# Altium schematic sheet [03] BLE_KEY_LED.SchDoc: BLE module, LEDs, keypad, buzzer
size A3; Engineer: M. Folejewski; DocumentNumber: 3; SheetNumber: 3; SheetTotal: 4; PageSize: A3; Designators: 1-99
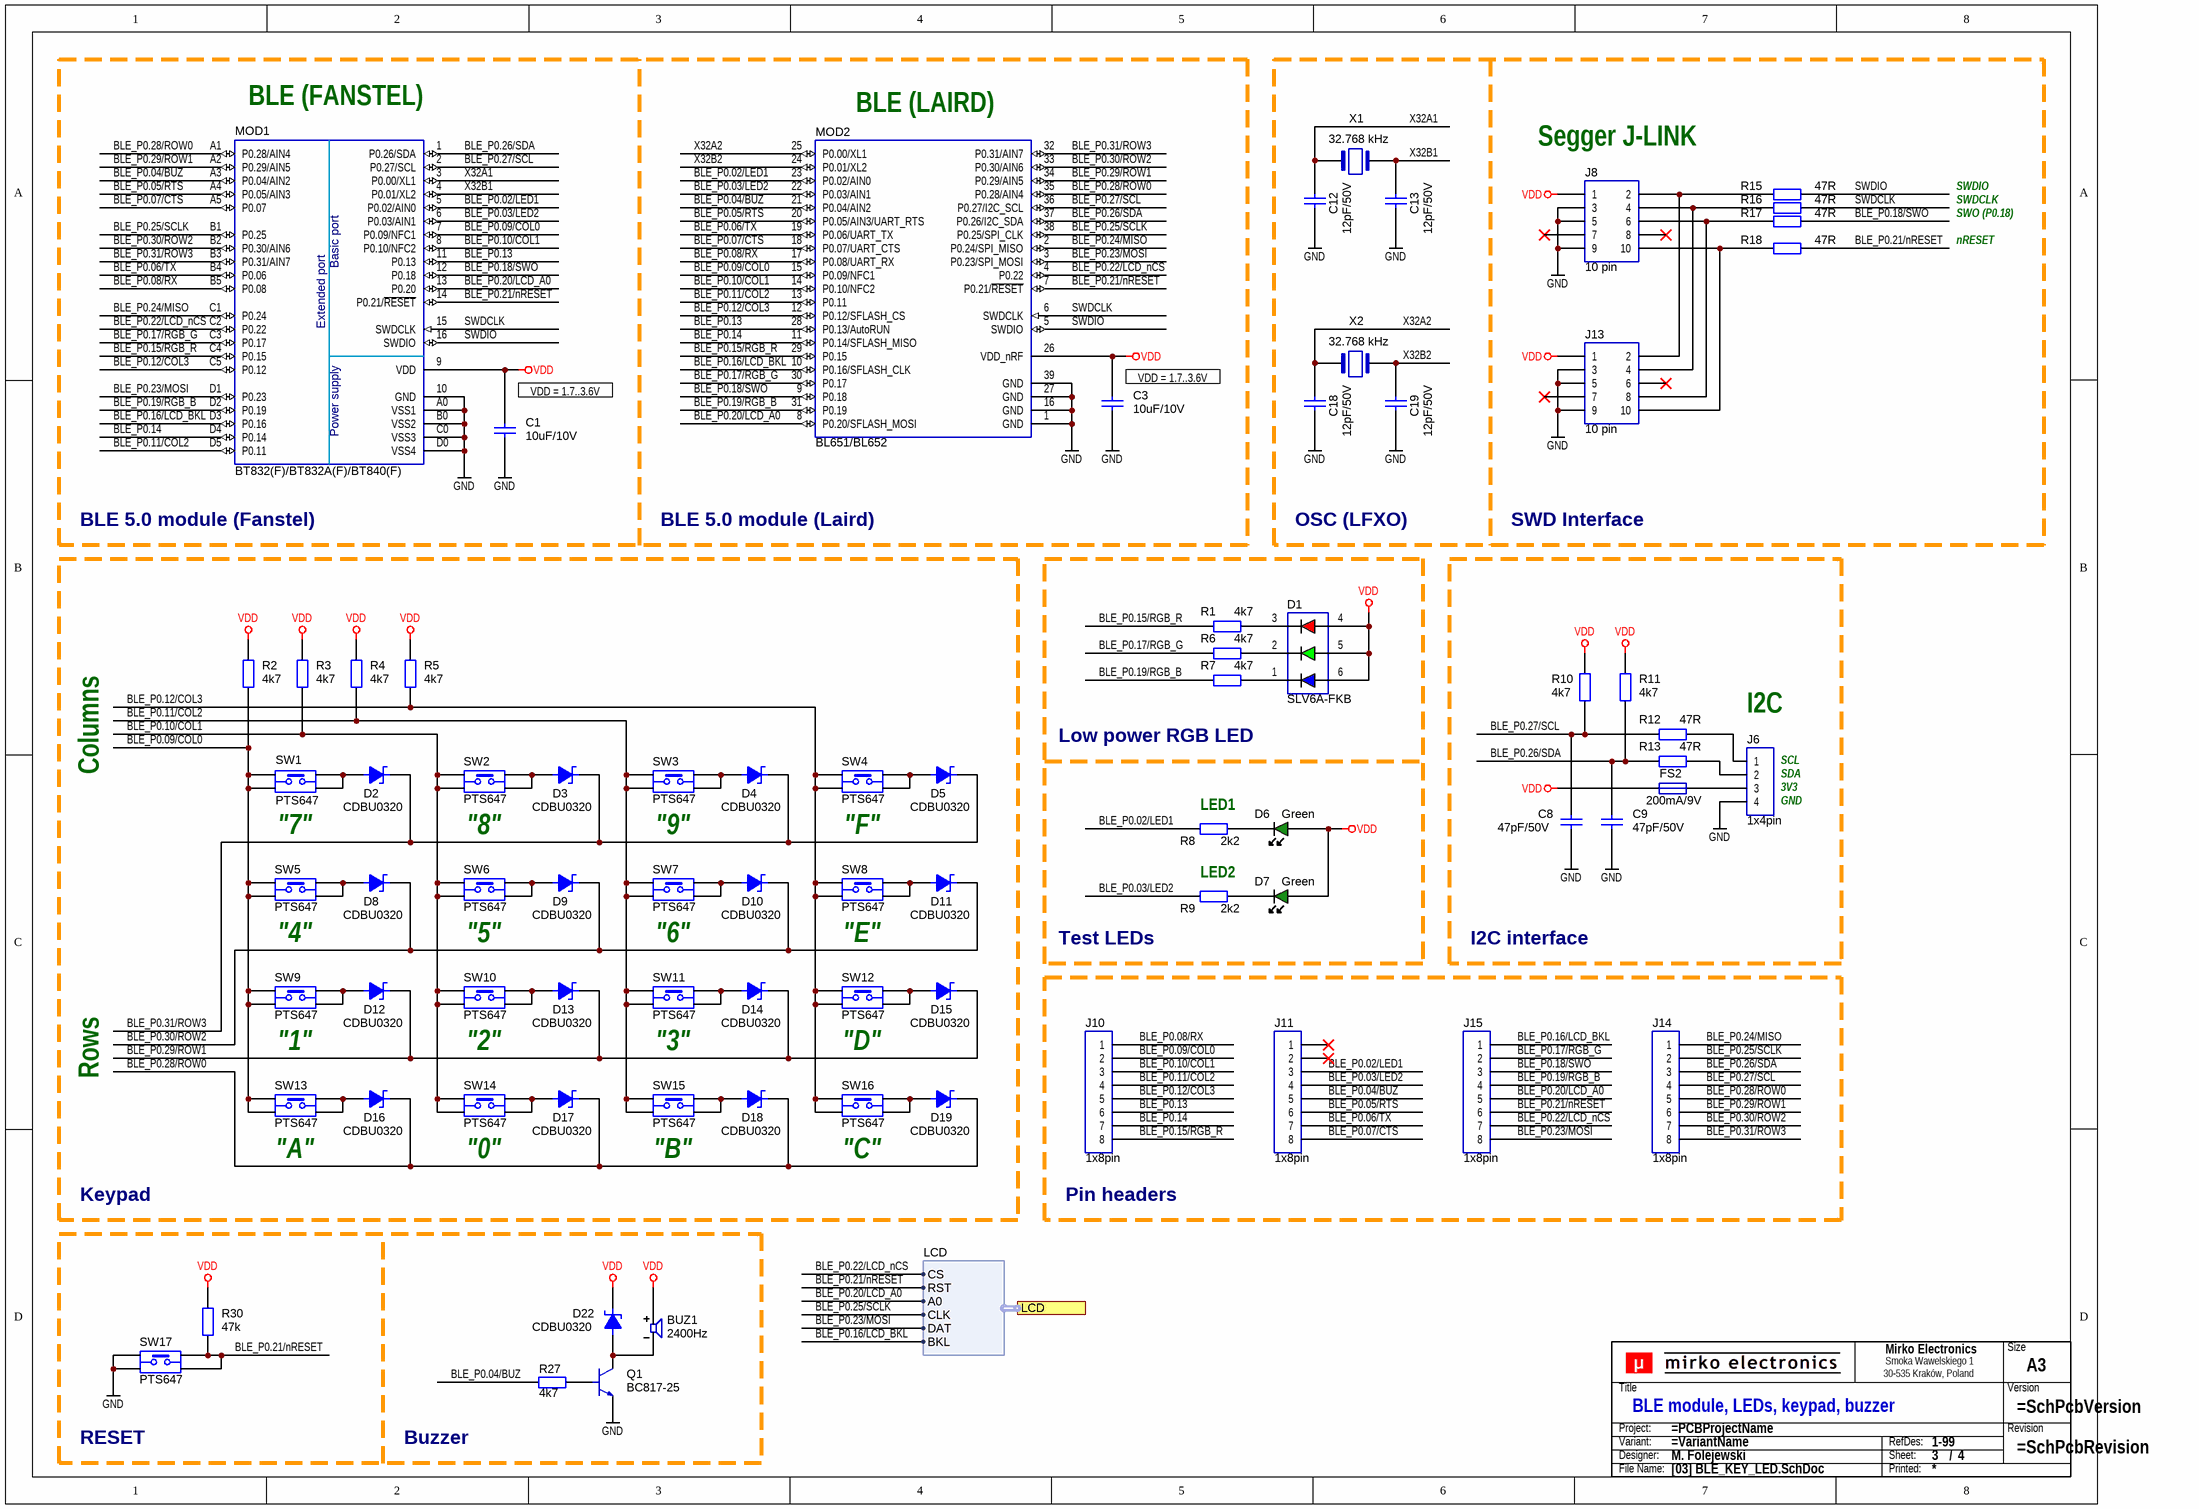
[diagram p0: [03] BLE_KEY_LED.SchDoc]

## Parts
BUZ1  2400Hz  [BUZ_LDT_SMB07]
C1  10uF/10V  [CAP_0805R]
C3  10uF/10V  [CAP_0805R]
C8  47pF/50V  [CAP_0603R]
C9  47pF/50V  [CAP_0603R]
C12  12pF/50V  [CAP_0603R]
C13  12pF/50V  [CAP_0603R]
C18  12pF/50V  [CAP_0603R]
C19  12pF/50V  [CAP_0603R]
D1  SLV6A-FKB  [LED_CRE_PLCC6_550_550]
D2  CDBU0320  [DIO_0603R]
D3  CDBU0320  [DIO_0603R]
D4  CDBU0320  [DIO_0603R]
D5  CDBU0320  [DIO_0603R]
D6  Green  [LED_0603R]
D7  Green  [LED_0603R]
D8  CDBU0320  [DIO_0603R]
D9  CDBU0320  [DIO_0603R]
D10  CDBU0320  [DIO_0603R]
D11  CDBU0320  [DIO_0603R]
D12  CDBU0320  [DIO_0603R]
D13  CDBU0320  [DIO_0603R]
D14  CDBU0320  [DIO_0603R]
D15  CDBU0320  [DIO_0603R]
D16  CDBU0320  [DIO_0603R]
D17  CDBU0320  [DIO_0603R]
D18  CDBU0320  [DIO_0603R]
D19  CDBU0320  [DIO_0603R]
D22  CDBU0320  [DIO_0603R]
FS2  200mA/9V  [FUS_ECE_SR0XX]
J6  1x4pin  [CON_WRT_691321100004]
J8  10 pin  [CON_SMT_FTSH-105-01-L-DV-K]
J10  1x8pin  [CON_HDR_P254_1X08]
J11  1x8pin  [CON_HDR_P254_1X08]
J13  10 pin  [CON_WRT_61201021621]
J14  1x8pin  [CON_HDR_P254_1X08]
J15  1x8pin  [CON_HDR_P254_1X08]
MOD1  BT832(F)/BT832A(F)/BT840(F)  [MOD_FNS_BT832_BT840_A/AF]
MOD2  BL651/BL652  [MOD_LRD_BL651_BL652]
Q1  BC817-25  [PKG_SOT23-3_TO236]
R1  4k7  [RES_0603R]
R2  4k7  [RES_0603R]
R3  4k7  [RES_0603R]
R4  4k7  [RES_0603R]
R5  4k7  [RES_0603R]
R6  4k7  [RES_0603R]
R7  4k7  [RES_0603R]
R8  2k2  [RES_0603R]
R9  2k2  [RES_0603R]
R10  4k7  [RES_0603R]
R11  4k7  [RES_0603R]
R12  47R  [RES_0603R]
R13  47R  [RES_0603R]
R15  47R  [RES_0603R]
R16  47R  [RES_0603R]
R17  47R  [RES_0603R]
R18  47R  [RES_0603R]
R27  4k7  [RES_0603R]
R30  47k  [RES_0603R]
SW1  PTS647  [SWI_CKS_PTS647Sx38]
SW2  PTS647  [SWI_CKS_PTS647Sx38]
SW3  PTS647  [SWI_CKS_PTS647Sx38]
SW4  PTS647  [SWI_CKS_PTS647Sx38]
SW5  PTS647  [SWI_CKS_PTS647Sx38]
SW6  PTS647  [SWI_CKS_PTS647Sx38]
SW7  PTS647  [SWI_CKS_PTS647Sx38]
SW8  PTS647  [SWI_CKS_PTS647Sx38]
SW9  PTS647  [SWI_CKS_PTS647Sx38]
SW10  PTS647  [SWI_CKS_PTS647Sx38]
SW11  PTS647  [SWI_CKS_PTS647Sx38]
SW12  PTS647  [SWI_CKS_PTS647Sx38]
SW13  PTS647  [SWI_CKS_PTS647Sx38]
SW14  PTS647  [SWI_CKS_PTS647Sx38]
SW15  PTS647  [SWI_CKS_PTS647Sx38]
SW16  PTS647  [SWI_CKS_PTS647Sx38]
SW17  PTS647  [SWI_CKS_PTS647Sx38]
TB?  Title block  (value not drawn)  (graphical)
X1  32.768 kHz  [OSC_EPS_FC-135]
X2  32.768 kHz  [OSC_EPS_FC-135]

## Ports
LCD (harness LCD)

## Harnesses
LCD: CS, RST, A0, CLK, DAT, BKL

## Nets
GND: C1.1 C3.1 C8.1 C9.1 C12.1 C13.1 C18.1 C19.1 J6.4 J8.3 J8.5 J8.9 J13.3 J13.5 J13.9 MOD1.10(GND) MOD1.A0(VSS1) MOD1.B0(VSS2) MOD1.C0(VSS3) MOD1.D0(VSS4) MOD2.1(GND) MOD2.16(GND) MOD2.27(GND) MOD2.39(GND) Q1.2(E) SW17.1 SW17.2
VDD: BUZ1.2 C1.2 C3.2 D1.4(AR) D1.5(AG) D1.6(AB) D6.2(A) D7.2(A) D22.1 FS2.1 J8.1 J13.1 MOD1.9(VDD) MOD2.26(VDD_nRF) R2.2 R3.2 R4.2 R5.2 R10.2 R11.2 R30.2
BLE_P0.02/LED1: J11.3 MOD1.5(P0.02/AIN0) MOD2.23(P0.02/AIN0) R8.2
BLE_P0.03/LED2: J11.4 MOD1.6(P0.03/AIN1) MOD2.22(P0.03/AIN1) R9.2
BLE_P0.04/BUZ: J11.5 MOD1.A3(P0.04/AIN2) MOD2.21(P0.04/AIN2) R27.2
BLE_P0.05/RTS: J11.6 MOD1.A4(P0.05/AIN3) MOD2.20(P0.05/AIN3/UART_RTS)
BLE_P0.06/TX: J11.7 MOD1.B4(P0.06) MOD2.19(P0.06/UART_TX)
BLE_P0.07/CTS: J11.8 MOD1.A5(P0.07) MOD2.18(P0.07/UART_CTS)
BLE_P0.08/RX: J10.1 MOD1.B5(P0.08) MOD2.17(P0.08/UART_RX)
BLE_P0.09/COL0: J10.2 MOD1.7(P0.09/NFC1) MOD2.15(P0.09/NFC1) R2.1 SW1.1 SW1.2 SW5.1 SW5.2 SW9.1 SW9.2 SW13.1 SW13.2
BLE_P0.10/COL1: J10.3 MOD1.8(P0.10/NFC2) MOD2.14(P0.10/NFC2) R3.1 SW2.1 SW2.2 SW6.1 SW6.2 SW10.1 SW10.2 SW14.1 SW14.2
BLE_P0.11/COL2: J10.4 MOD1.D5(P0.11) MOD2.13(P0.11) R4.1 SW3.1 SW3.2 SW7.1 SW7.2 SW11.1 SW11.2 SW15.1 SW15.2
BLE_P0.12/COL3: J10.5 MOD1.C5(P0.12) MOD2.12(P0.12/SFLASH_CS) R5.1 SW4.1 SW4.2 SW8.1 SW8.2 SW12.1 SW12.2 SW16.1 SW16.2
BLE_P0.13: J10.6 MOD1.11(P0.13) MOD2.28(P0.13/AutoRUN)
BLE_P0.14: J10.7 MOD1.D4(P0.14) MOD2.11(P0.14/SFLASH_MISO)
BLE_P0.15/RGB_R: J10.8 MOD1.C4(P0.15) MOD2.29(P0.15) R1.1
BLE_P0.16/LCD_BKL: J15.1 MOD1.D3(P0.16) MOD2.10(P0.16/SFLASH_CLK) ; port LCD.BKL
BLE_P0.17/RGB_G: J15.2 MOD1.C3(P0.17) MOD2.30(P0.17) R6.1
BLE_P0.18/SWO: J15.3 MOD1.12(P0.18) MOD2.9(P0.18) R17.1
BLE_P0.19/RGB_B: J15.4 MOD1.D2(P0.19) MOD2.31(P0.19) R7.1
BLE_P0.20/LCD_A0: J15.5 MOD1.13(P0.20) MOD2.8(P0.20/SFLASH_MOSI) ; port LCD.A0
BLE_P0.21/nRESET: J15.6 MOD1.14(P0.21/~{RESET}) MOD2.7(P0.21/~{RESET}) R18.1 R30.1 SW17.3 SW17.4 ; port LCD.RST
BLE_P0.22/LCD_nCS: J15.7 MOD1.C2(P0.22) MOD2.4(P0.22) ; port LCD.CS
BLE_P0.23/MOSI: J15.8 MOD1.D1(P0.23) MOD2.3(P0.23/SPI_MOSI) ; port LCD.DAT
BLE_P0.24/MISO: J14.1 MOD1.C1(P0.24) MOD2.2(P0.24/SPI_MISO)
BLE_P0.25/SCLK: J14.2 MOD1.B1(P0.25) MOD2.38(P0.25/SPI_CLK) ; port LCD.CLK
BLE_P0.26/SDA: C9.2 J14.3 MOD1.1(P0.26/SDA) MOD2.37(P0.26/I2C_SDA) R11.1 R13.2
BLE_P0.27/SCL: C8.2 J14.4 MOD1.2(P0.27/SCL) MOD2.36(P0.27/I2C_SCL) R10.1 R12.2
BLE_P0.28/ROW0: D16.1 D17.1 D18.1 D19.1 J14.5 MOD1.A1(P0.28/AIN4) MOD2.35(P0.28/AIN4)
BLE_P0.29/ROW1: D12.1 D13.1 D14.1 D15.1 J14.6 MOD1.A2(P0.29/AIN5) MOD2.34(P0.29/AIN5)
BLE_P0.30/ROW2: D8.1 D9.1 D10.1 D11.1 J14.7 MOD1.B2(P0.30/AIN6) MOD2.33(P0.30/AIN6)
BLE_P0.31/ROW3: D2.1 D3.1 D4.1 D5.1 J14.8 MOD1.B3(P0.31/AIN7) MOD2.32(P0.31/AIN7)
SWDCLK: MOD1.15(SWDCLK) MOD2.6(SWDCLK) R16.1
SWDIO: MOD1.16(SWDIO) MOD2.5(SWDIO) R15.1
X32A1: C12.2 MOD1.3(P0.00/XL1) X1.1
X32A2: C18.2 MOD2.25(P0.00/XL1) X2.1
X32B1: C13.2 MOD1.4(P0.01/XL2) X1.2
X32B2: C19.2 MOD2.24(P0.01/XL2) X2.2
NetBUZ1_1: BUZ1.1 D22.2 Q1.3(C)
NetD1_1: D1.1(CB) R7.2
NetD1_2: D1.2(CG) R6.2
NetD1_3: D1.3(CR) R1.2
NetD2_2: D2.2 SW1.3 SW1.4
NetD3_2: D3.2 SW2.3 SW2.4
NetD4_2: D4.2 SW3.3 SW3.4
NetD5_2: D5.2 SW4.3 SW4.4
NetD6_1: D6.1(K) R8.1
NetD7_1: D7.1(K) R9.1
NetD8_2: D8.2 SW5.3 SW5.4
NetD9_2: D9.2 SW6.3 SW6.4
NetD10_2: D10.2 SW7.3 SW7.4
NetD11_2: D11.2 SW8.3 SW8.4
NetD12_2: D12.2 SW9.3 SW9.4
NetD13_2: D13.2 SW10.3 SW10.4
NetD14_2: D14.2 SW11.3 SW11.4
NetD15_2: D15.2 SW12.3 SW12.4
NetD16_2: D16.2 SW13.3 SW13.4
NetD17_2: D17.2 SW14.3 SW14.4
NetD18_2: D18.2 SW15.3 SW15.4
NetD19_2: D19.2 SW16.3 SW16.4
NetFS2_2: FS2.2 J6.3
NetJ6_1: J6.1 R12.1
NetJ6_2: J6.2 R13.1
NetJ8_2: J8.2 J13.2 R15.2
NetJ8_4: J8.4 J13.4 R16.2
NetJ8_6: J8.6 J13.8 R17.2
NetJ8_10: J8.10 J13.10 R18.2
NetQ1_1: Q1.1(B) R27.1

Not connected (* = marked no-connect by the designer): J8 7* 8*; J11 1* 2*; J13 6* 7*

## Notes on the sheet
- (near MOD1) BLE (FANSTEL)
- (near MOD2) BLE (LAIRD)
- Segger J-LINK
- SWDIO
- SWDCLK
- nRESET
- SWO (P0.18)
- (near C3) VDD = 1.7..3.6V
- (near C1) VDD = 1.7..3.6V
- BLE 5.0 module (Fanstel)
- BLE 5.0 module (Laird)
- OSC (LFXO)
- SWD Interface
- I2C
- Columns
- Low power RGB LED
- (near J6) SDA
- (near J6) SCL
- (near SW1) "7"
- (near SW2) "8"
- (near SW3) "9"
- (near SW4) "F"
- (near R8) LED1
- (near J6) 3V3
- (near J6) GND
- (near R9) LED2
- (near SW5) "4"
- (near SW6) "5"
- (near SW7) "6"
- (near SW8) "E"
- Test LEDs
- I2C interface
- (near SW9) "1"
- (near SW10) "2"
- (near SW11) "3"
- (near SW12) "D"
- Rows
- (near SW13) "A"
- (near SW14) "0"
- (near SW15) "B"
- (near SW16) "C"
- Keypad
- (near J10) Pin headers
- RESET
- Buzzer
- (in symbol MOD_FNS_BT832_BT840_A/AF) Basic port; Extended port; Power supply
- (in symbol SCH_TITLE_BLOCK_V1) Mirko Electronics; Size; Smoka Wawelskiego 1; 30-535 Kraków, Poland; Title; Version; Project:; Revision; Variant:; RefDes:; Designer:; Sheet:; /; File Name:; Printed:

## Library data of the parts
BUZ1 = BUZ_LDT_LD-BZEL-B07-1212: Buzzer; Manufacturer: Loudity; Specification: Buzzer, internal generator, 2400Hz, 30mA, 85dB, SMD package; Replacement: NO; Component Type: Buzzer; Mounting Type: SMD; MPN: LD-BZEL-B07-1212; Operating Temperature: -30°C to +80°C; Package: SMD; Value: 2400Hz; System: ?
C1 C3 = CAP: Manufacturer: Murata Electronics; MPN: GRM21BR71A106KA73K; Specification: Capacitor, MLCC, 10uF, 10V, X7R, 10%, SMD 0805 (2012); Replacement: YES; Component Type: Capacitor; Mounting Type: SMD; Package: SMD 0805 (2012); Value: 10uF/10V; Operating Temperature: -55°C to +125°C
C8 C9 = CAP: Manufacturer: Yageo; MPN: CC0603JRNPO9BN470; Specification: Capacitor, MLCC, 47pF, 50V, C0G, 5%, SMD 0603 (1608); Replacement: YES; Component Type: Capacitor; Mounting Type: SMD; Package: SMD 0603 (1608); Value: 47pF/50V; Operating Temperature: -55°C to +125°C
C12 C13 C18 C19 = CAP: Manufacturer: AVX; MPN: 06035A120JAT2A; Specification: Capacitor, MLCC, 12pF, 50V, C0G, 5%, SMD 0603 (1608); Replacement: YES; Component Type: Capacitor; Mounting Type: SMD; Package: SMD 0603 (1608); Value: 12pF/50V; Operating Temperature: -55°C to +125°C
D1 = LED_CRE_SLV6A-FKB-CKNPRGJBB7a363: LED; Manufacturer: CREE; Replacement: YES; Specification: LED RGB diode, Red 560-1120 mcd, Green 1120-2240 mcd, Blue 280-560 mcd, PLCC6 package; Component Type: LED Diode; Mounting Type: SMD; MPN: SLV6A-FKB-CKNPRGJBB7a363; Operating Temperature: -40°C to +100°C; Package: SMD PLCC6; System: ?; Value: SLV6A-FKB
D2-D5 D8-D19 D22 = DIO_CMC_CDBU0320-HF: Diode; Manufacturer: Comchip Technology; Specification: Schottky Barrier Diode, 20V, 1.5A, SMD 0603 (1608) package; Replacement: YES; Component Type: Schottky Diode; Mounting Type: SMD; MPN: CDBU0320-HF; Operating Temperature: -40°C to +125°C; Package: SMD 0603 (1608); Value: CDBU0320; System: ?
D6 D7 = LED_WRT_150060VS55040: LED; Manufacturer: Wurth Elektronik; Replacement: YES; Specification: LED diode, green, 575nm, 60mcd, 140deg, 0603 package; Component Type: LED Diode; Mounting Type: SMD; MPN: 150060VS55040; Operating Temperature: -40°C to +85°C; Package: SMD 0603 (1608); System: ?; Value: Green
FS2 = FUS_ECE_SR0XX: Fuse; Manufacturer: ECE; MPN: SR020-09; Specification: Polymer fuse, 200mA, 9V, SMD 0805 (2012) package; Replacement: YES; Component Type: Polymer fuse; Mounting Type: SMD; Operating Temperature: -40°C to +85°C; Package: SMD 0805 (2012); Value: 200mA/9V; System: ?
J6 = CON_HDR_WRT_61300411121: CON; Manufacturer: Wurth Elektronik GmbH; MPN: 691321100004; Specification: Connector, terminal block, 1x4 pin, 3.50 pitch, vertical, THT package; Replacement: YES; Component Type: Connector; Mounting Type: THT; Operating Temperature: -40°C to +105°C; Package: THT; Value: 1x4pin; System: ?
J8 = Conn_2x5pin: Connector, 2x5 pin; Manufacturer: Samtec; MPN: FTSH-105-01-L-DV-K; Specification: Precision pin header, 1.27mm pitch, 10 pin, straight, male, double row, gold plated, SMD package; Replacement: YES; Component Type: Connector; Mounting Type: SMD; Operating Temperature: -55°C to +125°C; Package: SMD, 1.27mm pitch; Value: 10 pin; System: ?
J10 J11 J14 J15 = CON_HDR_1X08: Connector, 8pin; Manufacturer: Wurth Elektronik GmbH; MPN: 61300811121; Specification: Connector, pin header, 1x8 pin, single row, 2.54 pitch, straight pin, THT package; Replacement: YES; Component Type: Connector; Mounting Type: THT; Operating Temperature: -40°C to +125°C; Package: THT; Value: 1x8pin; System: ?
J13 = CON_HDR_2X05: Connector, 2x5pin; Manufacturer: Wurth Elektronik GmbH; MPN: 61201021621; Specification: Precision pin header, 2.54mm pitch, 10 pin, straight, male, double row, gold plated, THT package; Replacement: YES; Component Type: Connector; Mounting Type: THT; Operating Temperature: -55°C to +125°C; Package: THT, 2.54mm pitch; Value: 10 pin; System: ?
MOD1 = MOD_FNS_BT832_BT840_A/AF: PCB Module; Manufacturer: Fanstel Corp.; Replacement: YES; Specification: Bluetooth 5.0 + NFC module, Nordic nRF52810/nRF52832 QFN48, 192/512kB Flash + 24/64kB RAM, 14x16x1.9mm SMD package; Component Type: PCB Module; Mounting Type: SMD; MPN: BT832(F)/BT832A(F)/BT840(F); Operating Temperature: -40°C to +85°C; Package: PCB Module; System: ?; Value: BT832(F)/BT832A(F)/BT840(F)
MOD2 = MOD_LRD_BL651_BL652: PCB Module; Manufacturer: Laird Connectivity; Replacement: YES; Specification: Bluetooth 5.0 + NFC module, Nordic nRF52810/nRF52832 QFN48, 192/512kB Flash + 24/64kB RAM, 14x10x2.1mm SMD package; Component Type: PCB Module; Mounting Type: SMD; MPN: BL651/BL652; Operating Temperature: -40°C to +85°C; Package: PCB Module; System: ?; Value: BL651/BL652
Q1 = NPN_Transistor: NPN Transistor; Manufacturer: Nexperia (NXP); MPN: BC817-25,215; Specification: Bipolar transistor, NPN, 45V, 500mA; Replacement: YES; Component Type: Transistor; Mounting Type: SMD; Package: SOT23-3; Value: BC817-25; Operating Temperature: -65°C to +150°C
R1-R7 R10 R11 R27 = RES: Manufacturer: Yageo; MPN: RC0603FR-074K7L; Specification: Resistor, 4.7k, 1%, SMD 0603; Replacement: YES; Component Type: Resistor; Mounting Type: SMD; Package: SMD 0603 (1608); Value: 4k7; Operating Temperature: -55°C to +155°C; System: ?
R8 R9 = RES: Manufacturer: Yageo; MPN: RC0603FR-072K2L; Specification: Resistor, 2.2k, 1%, SMD 0603; Replacement: YES; Component Type: Resistor; Mounting Type: SMD; Package: SMD 0603 (1608); Value: 2k2; Operating Temperature: -55°C to +155°C
R12 R13 R15-R18 = RES: Manufacturer: Yageo; MPN: RC0603FR-0747RL; Specification: Resistor, 47R, 1%, SMD 0603 (1608); Replacement: YES; Component Type: Resistor; Mounting Type: SMD; Package: SMD 0603 (1608); Value: 47R; Operating Temperature: -55°C to +155°C
R30 = RES: Manufacturer: Yageo; MPN: RC0603FR-0747KL; Specification: Resistor, 47k, 1%, SMD 0603; Replacement: YES; Component Type: Resistor; Mounting Type: SMD; Package: SMD 0603 (1608); Value: 47k; Operating Temperature: -55°C to +155°C; System: ?
SW1-SW17 = SWI_CKS_PTS647SM38SMTR2LFS: Switch; Manufacturer: C&K Switches; Replacement: YES; Specification: Tactile switch, 50mA, 12VDC, 1.8N force, 3.8mm height, 3.0mm pitch, 4.5mm x 4.5mm size, SMD package; Component Type: Switch; Mounting Type: SMD; MPN: PTS647SM38SMTR2LFS; Operating Temperature: -20°C to +70°C; Package: SMD; System: ?; Value: PTS647
TB? = SCH_TITLE_BLOCK_V1: Component Type: Title block; Manufacturer: -; Mounting Type: Non component; MPN: -; Operating Temperature: -; Package: -; Specification: Title block; Value: Title block; Replacement: -; System: ?
X1 X2 = XTAL_EPS_FC-135_32.7680KA-A: XTAL; Manufacturer: Seiko Epson Corp.; MPN: FC-135 32.7680KA-A; Specification: Crystal, 32.768 kHz, 20ppm, 12.5pF, SMD 3.2x1.5x0.8mm package; Replacement: YES; Component Type: Crystal; Mounting Type: SMD; Operating Temperature: -40°C to +85°C; Package: SMD 3.2x1.5x0.8mm; Value: 32.768 kHz; System: ?